# EAGLE design tombol (EAGLE 7.6.0)
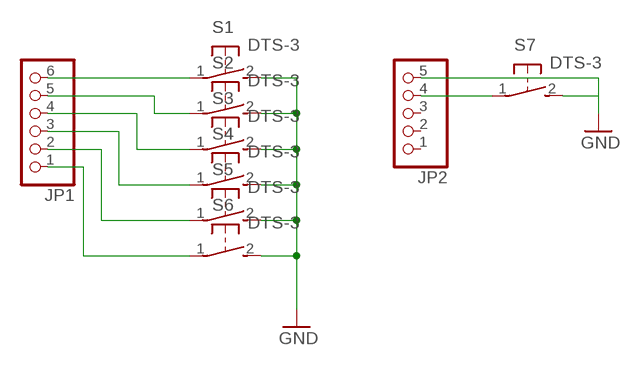
[diagram p0: schematic, sheet 1]

## Parts
JP1  PINHD-1X6  [1X06]
JP2  PINHD-1X5  [1X05]
S1  DTS-3  [DTS-3]
S2  DTS-3  [DTS-3]
S3  DTS-3  [DTS-3]
S4  DTS-3  [DTS-3]
S5  DTS-3  [DTS-3]
S6  DTS-3  [DTS-3]
S7  DTS-3  [DTS-3]

## Nets
GND: JP2.5 S1.2 S2.2 S3.2 S4.2 S5.2 S6.2 S7.2
N$4: JP1.6 S1.1
N$5: JP1.5 S2.1
N$6: JP1.4 S3.1
N$7: JP1.3 S4.1
N$8: JP1.2 S5.1
N$9: JP1.1 S6.1
N$10: JP2.4 S7.1
Unconnected: JP2.1 JP2.2 JP2.3

## Library data of the parts
JP1 = pinhead:PINHD-1X6: PIN HEADER
JP2 = pinhead:PINHD-1X5: PIN HEADER
S1-S7 = switch-tact:DTS-3

## Board
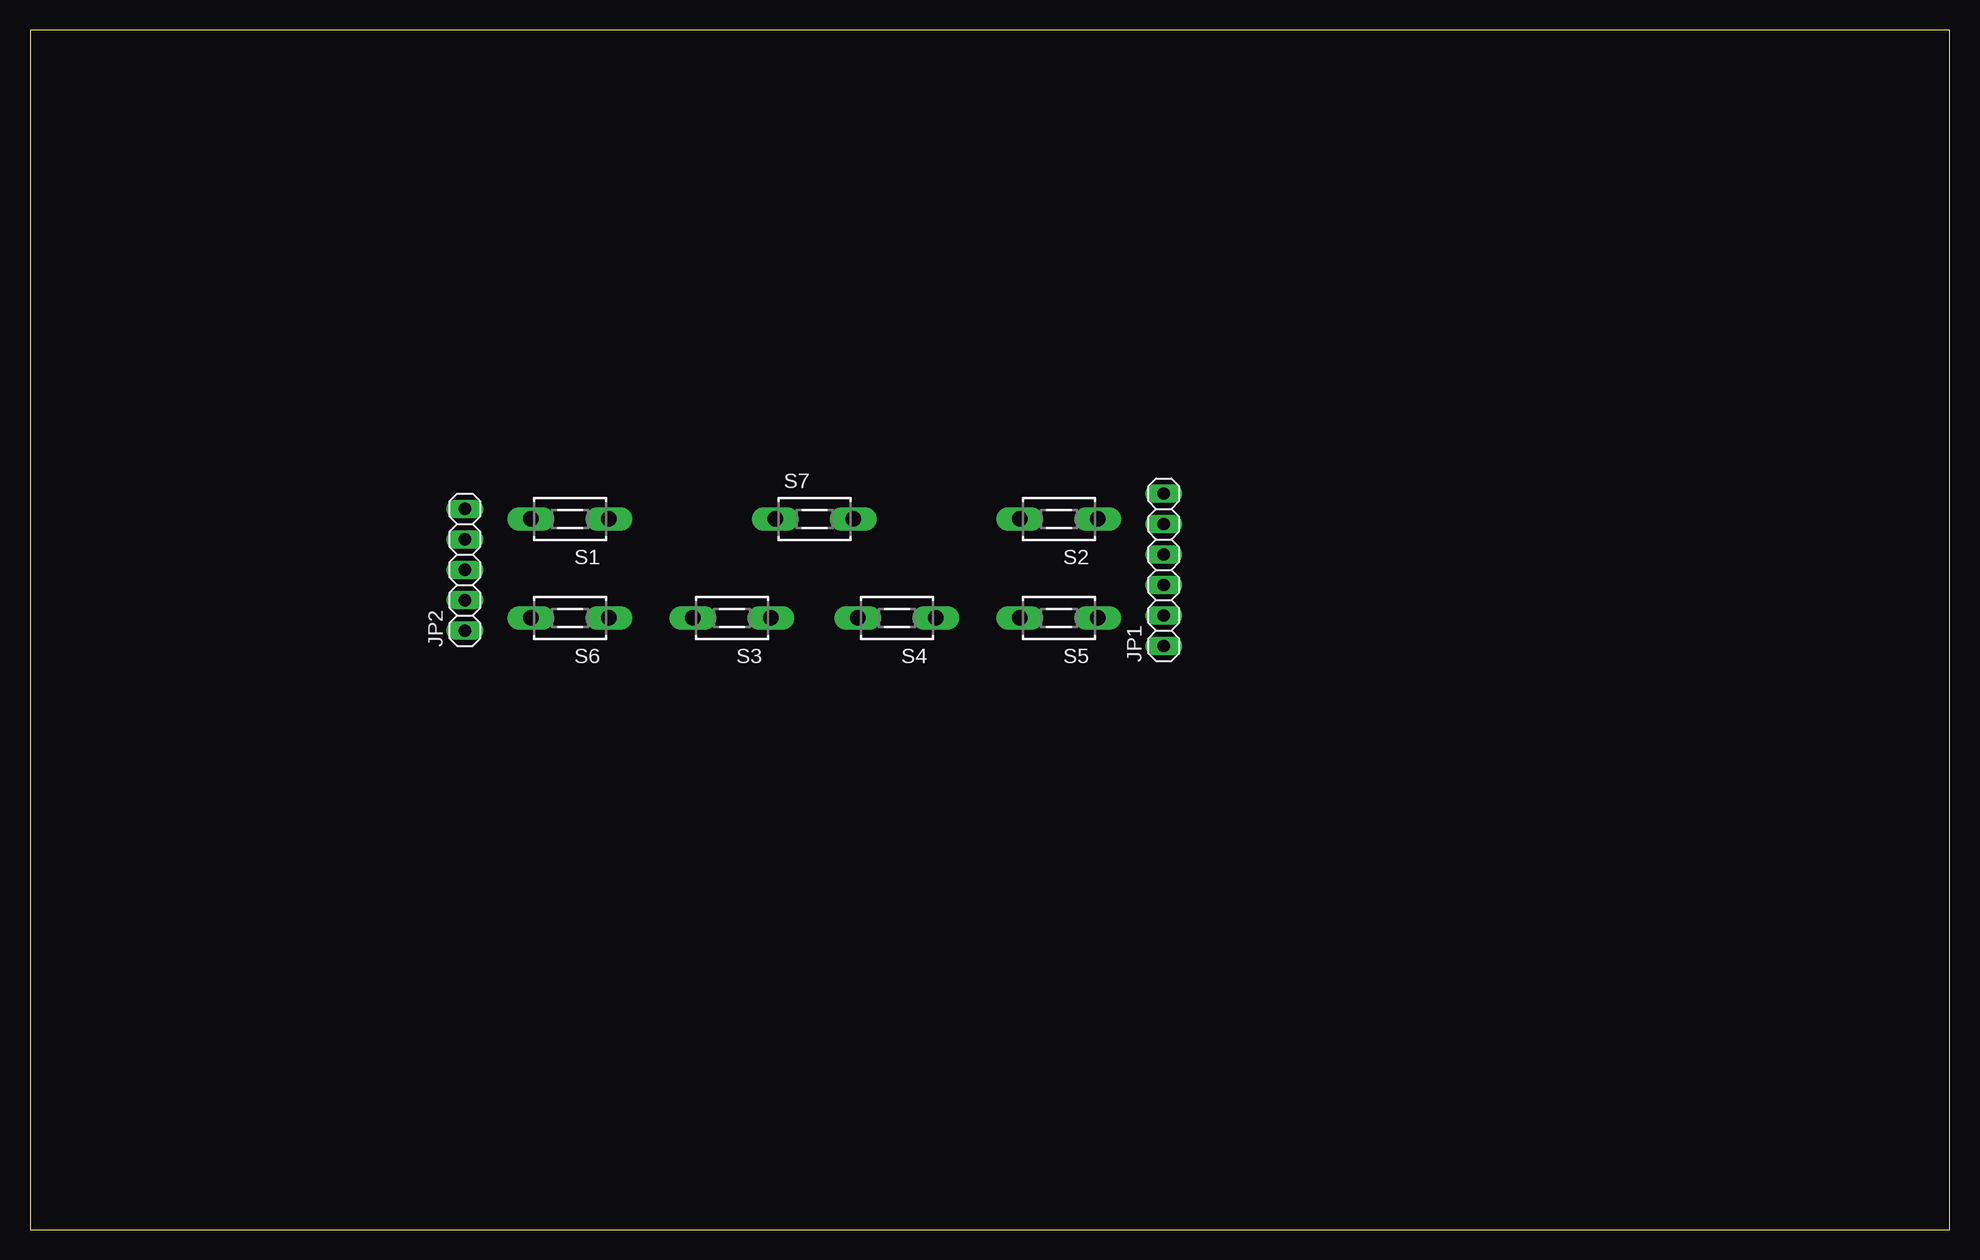
[diagram p1: board, top side]
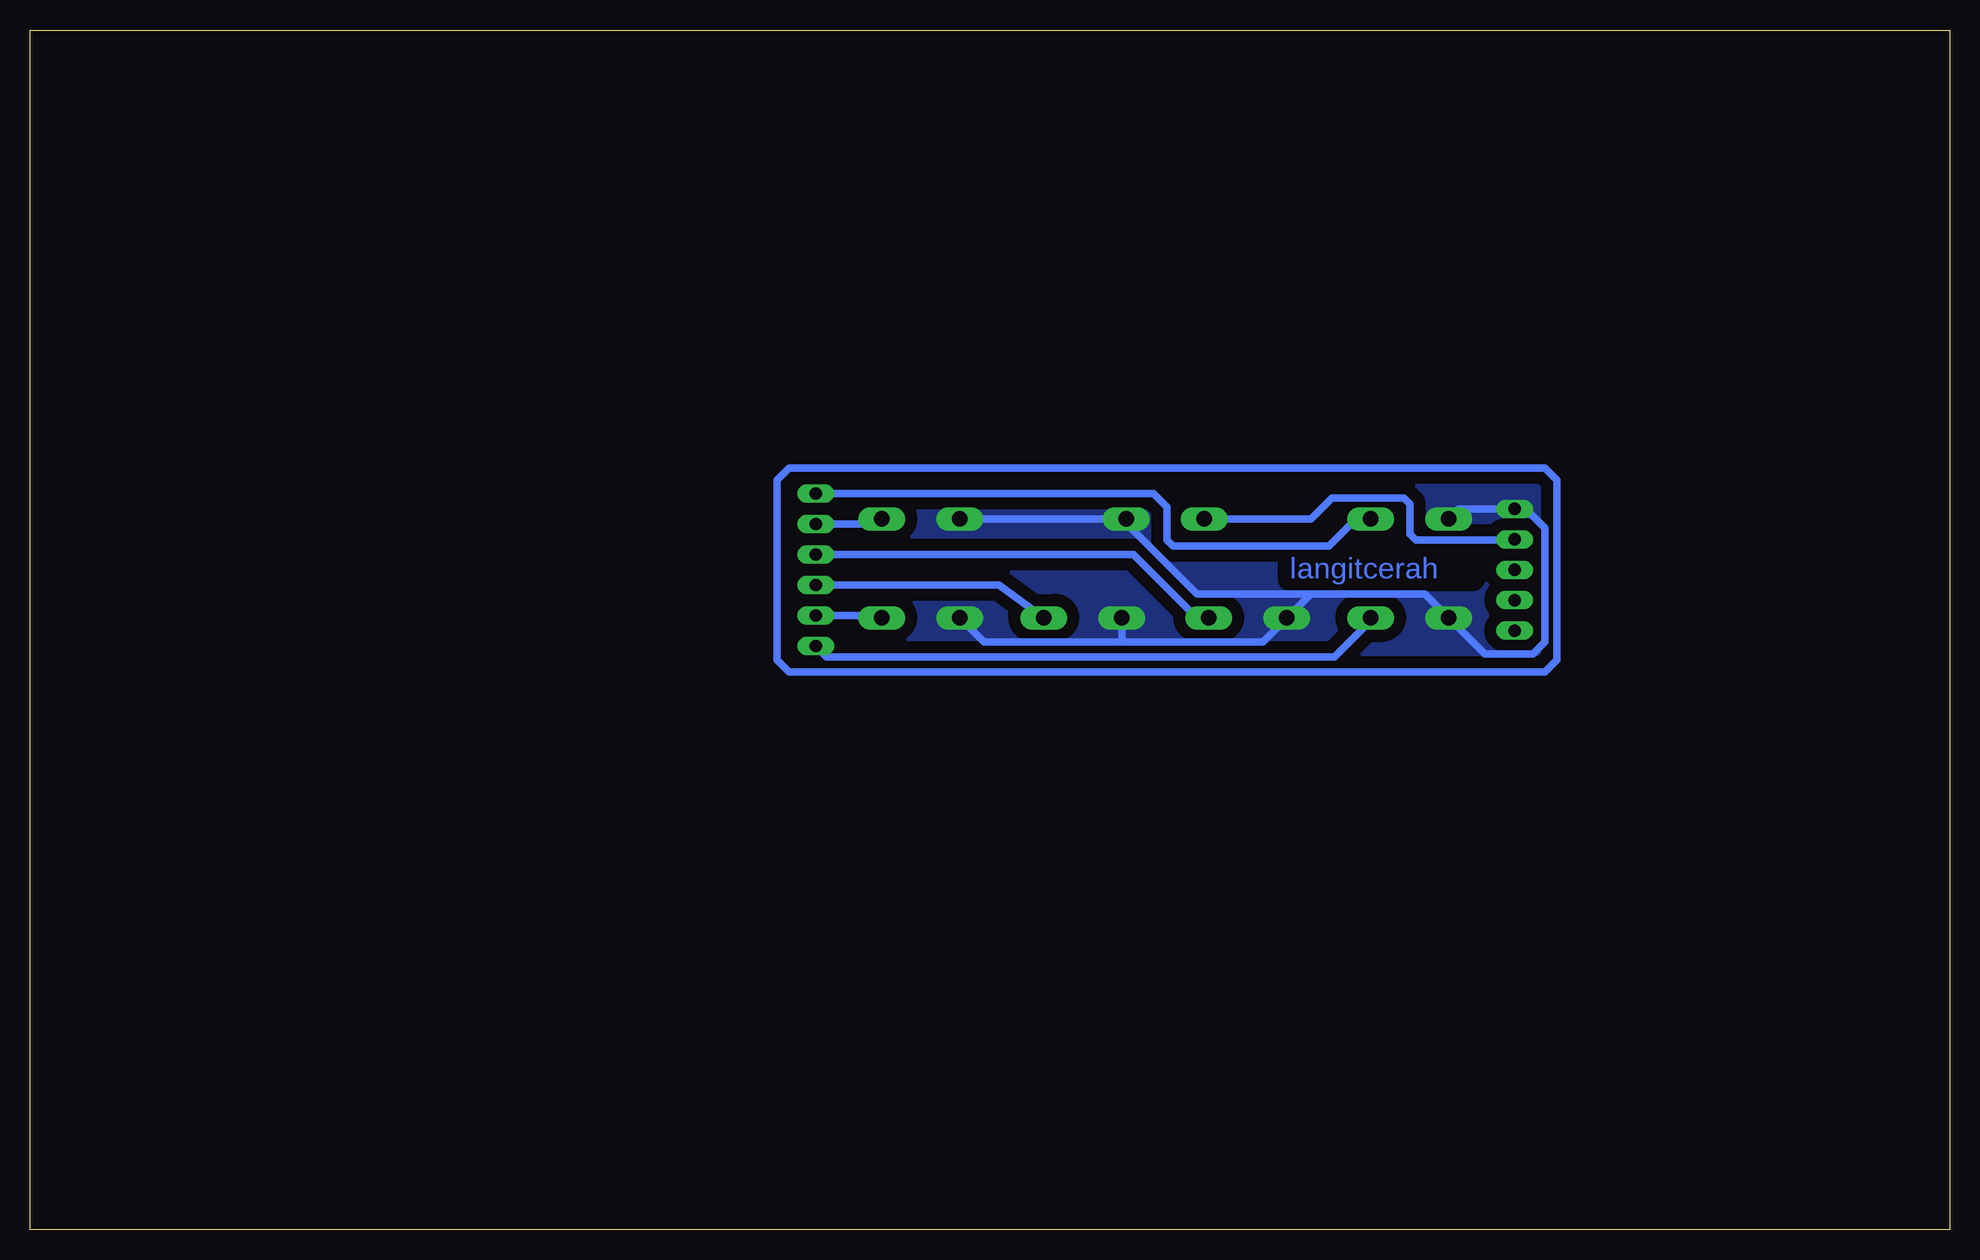
[diagram p2: board, bottom side, seen from below]

Size 160 x 100 mm. Coordinates in mm from the lower left corner, seen from the top.
Outline: 0,0 160,0 160,100 0,100 0,0
Copper layers (1*16): Top 0.035mm / dielectric 1.5mm / Bottom 0.035mm
Design rules "default": minimum track width 10mil, minimum drill 24mil, track to track 8mil, track to pad 8mil, pad to pad 8mil, via to via 8mil, smd to smd 8mil, copper to edge 40mil, drill to drill 8mil, minimum pad ring 10mil, minimum via ring 8mil, stop-mask expansion 4mil, vias tented up to drill 0mil, thermal gap 10mil

### Footprints (pad centres in the part's own frame; a part is rotated, then mirrored left to right if it is on the bottom)
1X06 = drill 1.016 long: 1 -6.35,0; 2 -3.81,0; 3 -1.27,0; 4 1.27,0; 5 3.81,0; 6 6.35,0
1X05 = drill 1.016 long: 1 -5.08,0; 2 -2.54,0; 3 0,0; 4 2.54,0; 5 5.08,0
DTS-3 = drill 1.3 long: 1 -3.25,0; 2 3.25,0

### Placement (x,y rotation side)
JP1  94.5,55 90 top
JP2  36.25,55 90 top
S1  45,59.25 180 top
S2  85.75,59.25 180 top
S3  58.5,51 180 top
S4  72.25,51 180 top
S5  85.75,51 180 top
S6  45,51 180 top
S7  65.38,59.25 0 top

### Tracks (layer width: path | path; a pad name or v marks a point on that pad's centre or on a via)
GND
  Bottom 0.61: JP2.5 37.25,60.08 | 37.25,60.08 37.17,60 35.25,60 33.75,58.5 33.75,49 34.75,48 38.75,48 S6.2 43.75,53 53.25,53 | 37.25,60.08 40.92,60.08 S1.2 | S5.2 80.5,49 69,49 | 69,49 57.25,49 S3.2 53.25,53 | S4.2 69,49 | 53.25,53 62.75,53 68.62,58.88 S7.2 S2.2
  pour Bottom (isolate 1.016, no thermals): 33.75,63.5 96.75,63.5 97.75,62.5 97.75,47.5 96.75,46.5 33.75,46.5 32.75,47.5 32.75,62.5
N$3
  Bottom 0.61: 33.75,63.5 96.75,63.5 97.75,62.5 97.75,47.5 96.75,46.5 33.75,46.5 32.75,47.5 32.75,62.5 33.75,63.5
N$4
  Bottom 0.61: JP1.6 66.35,61.35 65.25,60.25 65.25,57.5 64.75,57 51.75,57 49.5,59.25 S1.1
N$5
  Bottom 0.61: JP1.5 89.44,58.81 S2.1
N$6
  Bottom 0.61: JP1.4 68.02,56.27 62.75,51 S3.1
N$7
  Bottom 0.61: JP1.3 79.23,53.73 S4.1
N$8
  Bottom 0.61: JP1.2 90.94,51.19 90.75,51 S5.1
N$9
  Bottom 0.61: JP1.1 93.6,47.75 51.27,47.75 48.25,50.77 S6.1
N$10
  Bottom 0.61: JP2.4 36.25,57.5 44.5,57.5 45,58 45,60.5 45.5,61 51.5,61 53.25,59.25 S7.1

### Text on the board
Bottom: langitcerah